# Altium schematic sheet RcMPPT-BMS-AFE2.SchDoc: RcMPPT-BMS-AFE2
size A4; Author: Thomas Hofmann; CompanyName: HTL St. Pölten; Organization: Altium Limited; Address1: RcMPPT; Address2: Frenchs Forest; Address3: NSW; Address4: Australia 2086; DocumentNumber: 3; Revision: 2.0; SheetNumber: 3; SheetTotal: 5
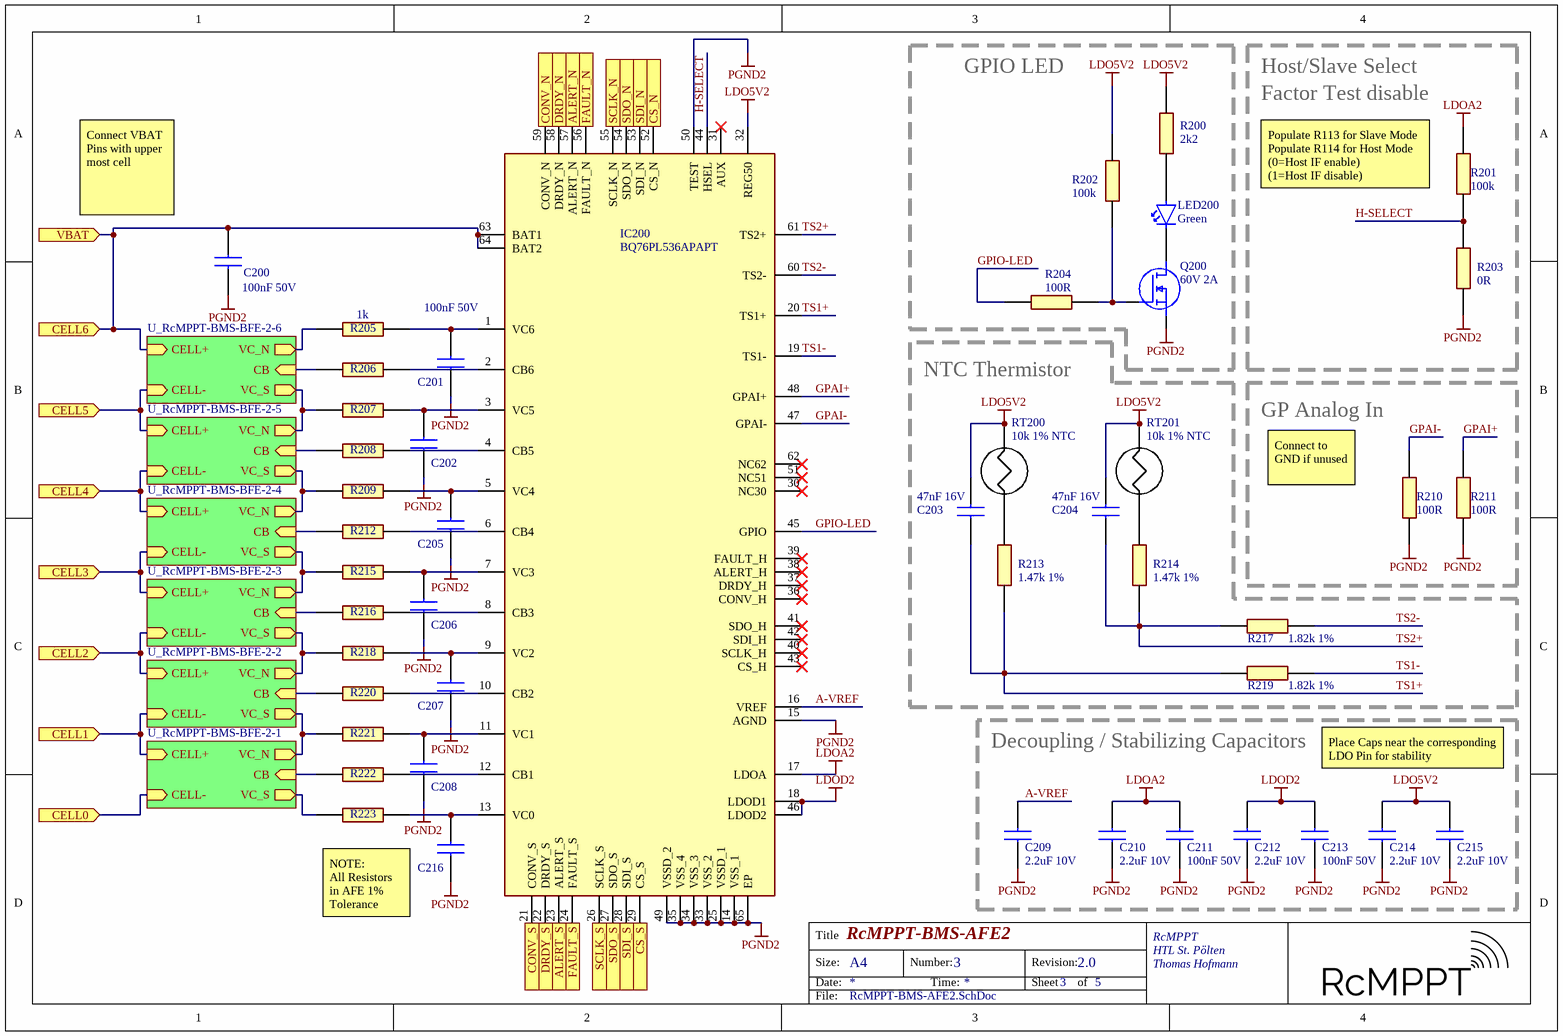
[diagram p0: RcMPPT-BMS-AFE2.SchDoc]

## Parts
C200  100nF 50V  [CAPC1608X97N]
C201  100nF 50V  [CAPC1608X97N]
C202  100nF 50V  [CAPC1608X97N]  (value not drawn)
C203  47nF 16V  [CAPC1608X97N]
C204  47nF 16V  [CAPC1608X97N]
C205  100nF 50V  [CAPC1608X97N]  (value not drawn)
C206  100nF 50V  [CAPC1608X97N]  (value not drawn)
C207  100nF 50V  [CAPC1608X97N]  (value not drawn)
C208  100nF 50V  [CAPC1608X97N]  (value not drawn)
C209  2.2uF 10V  [CAPC1608X97N]
C210  2.2uF 10V  [CAPC1608X97N]
C211  100nF 50V  [CAPC1608X97N]
C212  2.2uF 10V  [CAPC1608X97N]
C213  100nF 50V  [CAPC1608X97N]
C214  2.2uF 10V  [CAPC1608X97N]
C215  2.2uF 10V  [CAPC1608X97N]
C216  100nF 50V  [CAPC1608X97N]  (value not drawn)
IC200  BQ76PL536APAPT  [QFP50P1200X1200X120-65N]
LED200  Green  [CHIPLED_0603]
Q200  60V 2A  [SOT96P240X110-3N]
R200  2k2  [RESC1005X40N]
R201  100k  [RESC1005X40N]
R202  100k  [RESC1005X40N]
R203  0R  [RESC1005X40N]
R204  100R  [RESC1005X40N]
R205  1k  [RESC1005X40N]
R206  1k  [RESC1005X40N]  (value not drawn)
R207  1k  [RESC1005X40N]  (value not drawn)
R208  1k  [RESC1005X40N]  (value not drawn)
R209  1k  [RESC1005X40N]  (value not drawn)
R210  100R  [RESC1005X40N]
R211  100R  [RESC1005X40N]
R212  1k  [RESC1005X40N]  (value not drawn)
R213  1.47k 1%  [RESC1608X50N]
R214  1.47k 1%  [RESC1608X50N]
R215  1k  [RESC1005X40N]  (value not drawn)
R216  1k  [RESC1005X40N]  (value not drawn)
R217  1.82k 1%  [RESC1608X50N]
R218  1k  [RESC1005X40N]  (value not drawn)
R219  1.82k 1%  [RESC1608X50N]
R220  1k  [RESC1005X40N]  (value not drawn)
R221  1k  [RESC1005X40N]  (value not drawn)
R222  1k  [RESC1005X40N]  (value not drawn)
R223  1k  [RESC1005X40N]  (value not drawn)
RT200  10k 1% NTC  [THRMC1608X90N]
RT201  10k 1% NTC  [THRMC1608X90N]

## Blocks framed on the sheet
GPIO LED: LED200 Q200 R200 R202 R204
NTC Thermistor: C203 C204 R213 R214 R217 R219 RT200 RT201
GP Analog In: R210 R211
Decoupling / Stabilizing Capacitors: C209-C215

## Sub-sheets
U_RcMPPT-BMS-BFE-2-1 = RcMPPT-BMS-BFE.SchDoc: CB (in), VC_S (out), CELL+ (in), CELL- (in), VC_N (out)
U_RcMPPT-BMS-BFE-2-2 = RcMPPT-BMS-BFE.SchDoc: CB (in), VC_S (out), CELL+ (in), CELL- (in), VC_N (out)
U_RcMPPT-BMS-BFE-2-3 = RcMPPT-BMS-BFE.SchDoc: CB (in), VC_S (out), CELL+ (in), CELL- (in), VC_N (out)
U_RcMPPT-BMS-BFE-2-4 = RcMPPT-BMS-BFE.SchDoc: CB (in), VC_S (out), CELL+ (in), CELL- (in), VC_N (out)
U_RcMPPT-BMS-BFE-2-5 = RcMPPT-BMS-BFE.SchDoc: CB (in), VC_S (out), CELL+ (in), CELL- (in), VC_N (out)
U_RcMPPT-BMS-BFE-2-6 = RcMPPT-BMS-BFE.SchDoc: CB (in), VC_S (out), CELL+ (in), CELL- (in), VC_N (out)

## Ports
ALERT_N (out), ALERT_S (in), CELL0 (in), CELL1 (in), CELL2 (in), CELL3 (in), CELL4 (in), CELL5 (in), CELL6 (in), CONV_N (out), CONV_S (in), CS_N (out), CS_S (in), DRDY_N (out), DRDY_S (in), FAULT_N (out), FAULT_S (in), SCLK_N (out), SCLK_S (in), SDI_N (out), SDI_S (in), SDO_N (out), SDO_S (in), VBAT (in)

## Nets
LDO5V2: C203.2 C204.2 C214.2 C215.2 IC200.32(REG50) R200.2 R202.2 RT200.2 RT201.2
LDOA2: C210.2 C211.2 IC200.17(LDOA) R201.2
LDOD2: C212.2 C213.2 IC200.18(LDOD1) IC200.46(LDOD2)
PGND2: C200.1 C201.1 C202.1 C205.1 C206.1 C207.1 C208.1 C209.1 C210.1 C211.1 C212.1 C213.1 C214.1 C215.1 C216.1 IC200.14(VSS_1) IC200.15(AGND) IC200.25(VSSD_1) IC200.33(VSS_2) IC200.34(VSS_3) IC200.35(VSS_4) IC200.49(VSSD_2) IC200.50(TEST) IC200.65(EP) Q200.2(S) R203.2 R210.2 R211.2
A-VREF: C209.2 IC200.16(VREF)
ALERT_N: IC200.57(ALERT_N) ; port ALERT_N
ALERT_S: IC200.23(ALERT_S) ; port ALERT_S
CELL0: port CELL0, sheet U_RcMPPT-BMS-BFE-2-1/CELL-
CELL1: port CELL1, sheet U_RcMPPT-BMS-BFE-2-1/CELL+, sheet U_RcMPPT-BMS-BFE-2-2/CELL-
CELL2: port CELL2, sheet U_RcMPPT-BMS-BFE-2-2/CELL+, sheet U_RcMPPT-BMS-BFE-2-3/CELL-
CELL3: port CELL3, sheet U_RcMPPT-BMS-BFE-2-3/CELL+, sheet U_RcMPPT-BMS-BFE-2-4/CELL-
CELL4: port CELL4, sheet U_RcMPPT-BMS-BFE-2-4/CELL+, sheet U_RcMPPT-BMS-BFE-2-5/CELL-
CELL5: port CELL5, sheet U_RcMPPT-BMS-BFE-2-5/CELL+, sheet U_RcMPPT-BMS-BFE-2-6/CELL-
CELL6: C200.2 IC200.63(BAT1) IC200.64(BAT2) ; port CELL6, port VBAT, sheet U_RcMPPT-BMS-BFE-2-6/CELL+
CONV_N: IC200.59(CONV_N) ; port CONV_N
CONV_S: IC200.21(CONV_S) ; port CONV_S
CS_N: IC200.52(CS_N) ; port CS_N
CS_S: IC200.29(CS_S) ; port CS_S
DRDY_N: IC200.58(DRDY_N) ; port DRDY_N
DRDY_S: IC200.22(DRDY_S) ; port DRDY_S
FAULT_N: IC200.56(FAULT_N) ; port FAULT_N
FAULT_S: IC200.24(FAULT_S) ; port FAULT_S
GPAI+: IC200.48(GPAI+) R211.1
GPAI-: IC200.47(GPAI-) R210.1
GPIO-LED: IC200.45(GPIO) R204.2
H-SELECT: IC200.44(HSEL) R201.1 R203.1
SCLK_N: IC200.55(SCLK_N) ; port SCLK_N
SCLK_S: IC200.26(SCLK_S) ; port SCLK_S
SDI_N: IC200.53(SDI_N) ; port SDI_N
SDI_S: IC200.28(SDI_S) ; port SDI_S
SDO_N: IC200.54(SDO_N) ; port SDO_N
SDO_S: IC200.27(SDO_S) ; port SDO_S
TS1+: C203.1 IC200.20(TS1+) R213.1 R219.2
TS1-: IC200.19(TS1-) R219.1
TS2+: C204.1 IC200.61(TS2+) R214.1 R217.2
TS2-: IC200.60(TS2-) R217.1
NetC201_2: C201.2 IC200.1(VC6) R205.2
NetC202_2: C202.2 IC200.3(VC5) R207.2
NetC205_2: C205.2 IC200.5(VC4) R209.2
NetC206_2: C206.2 IC200.7(VC3) R215.2
NetC207_2: C207.2 IC200.9(VC2) R218.2
NetC208_2: C208.2 IC200.11(VC1) R221.2
NetC216_2: C216.2 IC200.13(VC0) R223.2
NetIC200_2: IC200.2(CB6) R206.2
NetIC200_4: IC200.4(CB5) R208.2
NetIC200_6: IC200.6(CB4) R212.2
NetIC200_8: IC200.8(CB3) R216.2
NetIC200_10: IC200.10(CB2) R220.2
NetIC200_12: IC200.12(CB1) R222.2
NetLED200_1: LED200.1(K) Q200.3(D)
NetLED200_2: LED200.2(A) R200.1
NetQ200_1: Q200.1(G) R202.1 R204.1
NetR205_1: R205.1 ; sheet U_RcMPPT-BMS-BFE-2-6/VC_N
NetR206_1: R206.1 ; sheet U_RcMPPT-BMS-BFE-2-6/CB
NetR207_1: R207.1 ; sheet U_RcMPPT-BMS-BFE-2-5/VC_N, sheet U_RcMPPT-BMS-BFE-2-6/VC_S
NetR208_1: R208.1 ; sheet U_RcMPPT-BMS-BFE-2-5/CB
NetR209_1: R209.1 ; sheet U_RcMPPT-BMS-BFE-2-4/VC_N, sheet U_RcMPPT-BMS-BFE-2-5/VC_S
NetR212_1: R212.1 ; sheet U_RcMPPT-BMS-BFE-2-4/CB
NetR213_2: R213.2 RT200.1
NetR214_2: R214.2 RT201.1
NetR215_1: R215.1 ; sheet U_RcMPPT-BMS-BFE-2-3/VC_N, sheet U_RcMPPT-BMS-BFE-2-4/VC_S
NetR216_1: R216.1 ; sheet U_RcMPPT-BMS-BFE-2-3/CB
NetR218_1: R218.1 ; sheet U_RcMPPT-BMS-BFE-2-2/VC_N, sheet U_RcMPPT-BMS-BFE-2-3/VC_S
NetR220_1: R220.1 ; sheet U_RcMPPT-BMS-BFE-2-2/CB
NetR221_1: R221.1 ; sheet U_RcMPPT-BMS-BFE-2-1/VC_N, sheet U_RcMPPT-BMS-BFE-2-2/VC_S
NetR222_1: R222.1 ; sheet U_RcMPPT-BMS-BFE-2-1/CB
NetR223_1: R223.1 ; sheet U_RcMPPT-BMS-BFE-2-1/VC_S

Not connected (* = marked no-connect by the designer): IC200 30(NC30)* 31(AUX)* 36(CONV_H)* 37(DRDY_H)* 38(ALERT_H)* 39(FAULT_H)* 40(SCLK_H)* 41(SDO_H)* 42(SDI_H)* 43(CS_H)* 51(NC51)* 62(NC62)*

## Notes on the sheet
- Host/Slave Select
- (near R201) Factor Test disable
- Connect VBAT Pins with upper most cell
- (near R201) Populate R113 for Slave Mode
  Populate R114 for Host Mode
  (0=Host IF enable)
  (1=Host IF disable)
- Connect to GND if unused
- Place Caps near the corresponding LDO Pin for stability
- NOTE:
  All Resistors
  in AFE 1% Tolerance
- Title
- Size:
- Date:
- A4
- Number:
- Time:
- Revision:
- Sheet
- of
- RcMPPT
- File:

## Library data of the parts
C200-C216 = C0603: Capacitor; Height: 0.97
IC200 = BQ76PL536APAPT: Integrated Circuit; Manufacturer_Name: Texas Instruments; Datasheet Link: http://www.ti.com/lit/gpn/bq76pl536a; Height: 1.2mm; Manufacturer_Part_Number: BQ76PL536APAPT; Mouser Part Number: 595-BQ76PL536APAPT; Mouser Price/Stock: https://www.mouser.co.uk/ProductDetail/Texas-Instruments/BQ76PL536APAPT?qs=UlfnwZ2x8nT1EXA%252BD%252BEfIQ%3D%3D; Arrow Part Number: BQ76PL536APAPT; Arrow Price/Stock: https://www.arrow.com/en/products/bq76pl536apapt/texas-instruments?region=nac
LED200 = CHIPLED0603: LED; Mouser Price/Stock: https://www.mouser.at/c/optoelectronics/led-lighting/led-emitters/standard-leds-smd/?series=CHIPLED%200603&instock=y
Q200 = NMOS: MOSFET (N-Channel)
R200-R212 R215 R216 R218 R220-R223 = R0402: Resistor; Height: 0.4mm
R213 R214 R217 R219 = R0603: Resistor; Height: 0.55mm
RT200 RT201 = ERT-J1VG103FA: Thermistor; Manufacturer_Name: Panasonic; Datasheet Link: https://componentsearchengine.com/Datasheets/1/ERT-J1VG103FA.pdf; Height: 0.9mm; Manufacturer_Part_Number: ERT-J1VG103FA; Mouser Part Number: 667-ERT-J1VG103FA; Mouser Price/Stock: https://www.mouser.co.uk/ProductDetail/Panasonic/ERT-J1VG103FA?qs=Tap6ps20mlMpYFuAQ7bHkg%3D%3D; Arrow Part Number: ERT-J1VG103FA; Arrow Price/Stock: https://www.arrow.com/en/products/ert-j1vg103fa/panasonic